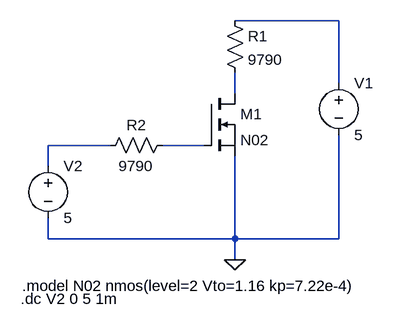
[diagram p0: schematic Practica5.1.asc]
Practica5.1.asc, the LTspice schematic file:
Version 4
SHEET 1 880 680
WIRE 368 0 208 0
WIRE 368 96 368 0
WIRE 208 112 208 80
WIRE 16 192 -80 192
WIRE 160 192 96 192
WIRE -80 224 -80 192
WIRE -80 336 -80 304
WIRE 208 336 208 208
WIRE 208 336 -80 336
WIRE 368 336 368 176
WIRE 368 336 208 336
WIRE 208 368 208 336
FLAG 208 368 0
SYMBOL nmos 160 112 R0
SYMATTR InstName M1
SYMATTR Value N02
SYMBOL voltage 368 80 R0
WINDOW 123 0 0 Left 0
WINDOW 39 0 0 Left 0
SYMATTR InstName V1
SYMATTR Value 5
SYMBOL voltage -80 208 R0
WINDOW 123 0 0 Left 0
WINDOW 39 0 0 Left 0
SYMATTR InstName V2
SYMATTR Value 5
SYMBOL res 192 -16 R0
SYMATTR InstName R1
SYMATTR Value 9790
SYMBOL res 112 176 R90
WINDOW 0 0 56 VBottom 2
WINDOW 3 32 56 VTop 2
SYMATTR InstName R2
SYMATTR Value 9790
TEXT -120 408 Left 2 !.model N02 nmos(level=2 Vto=1.16 kp=7.22e-4)
TEXT -122 428 Left 2 !.dc V2 0 5 1m

The netlist it stands for:
* Practica5.1.asc
M1 N002 N004 0 0 N02
V1 N001 0 5
V2 N003 0 5
R1 N001 N002 9790
R2 N004 N003 9790
.model NMOS NMOS
.model PMOS PMOS
.lib standard.mos
.model N02 nmos(level=2 Vto=1.16 kp=7.22e-4)
.dc V2 0 5 1m
.backanno
.end